# EasyEDA Pro project medulla_2026-05-01.epro

# Schematic Schematic1
Board Name: Board1; Create Date: 2025-12-13; Page Name: P1; Project Name: Kart Medulla (expander for ESP 32); Schematic Name: Schematic1; Update Date: 2026-04-26; Company: EasyEDA.com; Page Size: A4; Version: V1.0
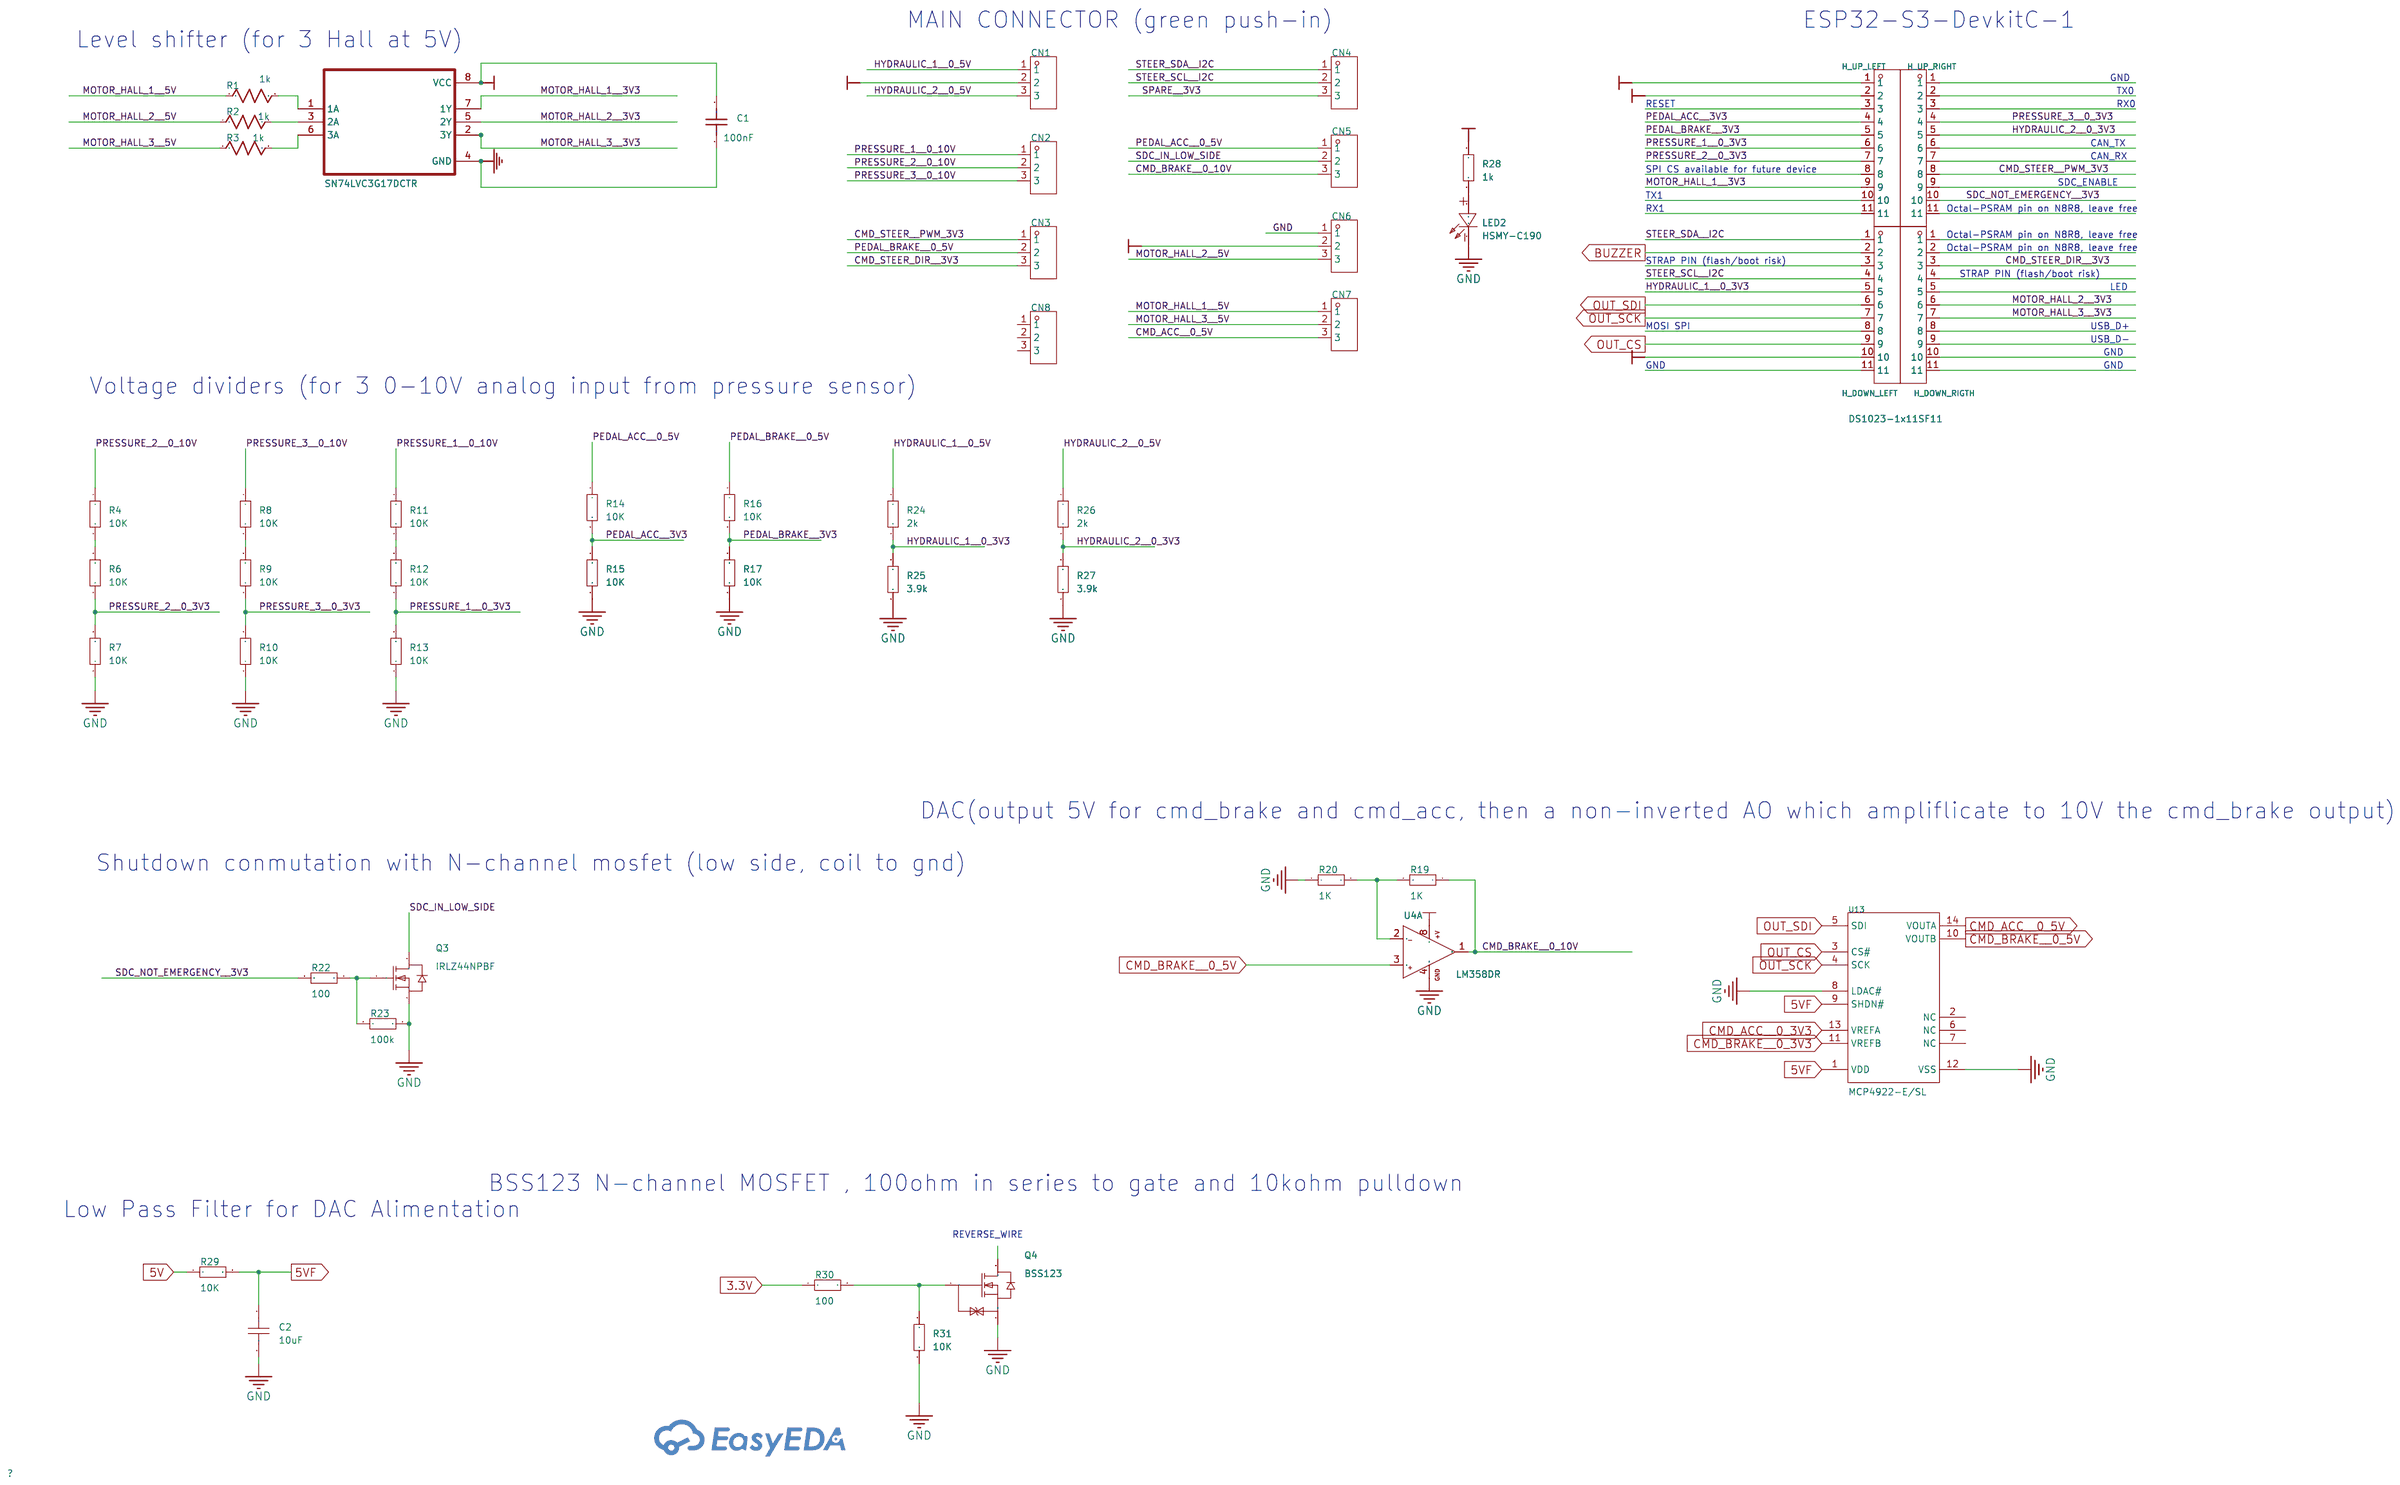
[diagram p0: schematic sheet]

## Parts
C1  100nF  [C0603]
C2  10uF  [C0603]
CN1  1990012  [CONN-TH_3P-P2.50-S5.00_1990012]
CN2  1990012  [CONN-TH_3P-P2.50-S5.00_1990012]
CN3  1990012  [CONN-TH_3P-P2.50-S5.00_1990012]
CN4  1990012  [CONN-TH_3P-P2.50-S5.00_1990012]
CN5  1990012  [CONN-TH_3P-P2.50-S5.00_1990012]
CN6  1990012  [CONN-TH_3P-P2.50-S5.00_1990012]
CN7  1990012  [CONN-TH_3P-P2.50-S5.00_1990012]
CN8  1990012  [CONN-TH_3P-P2.50-S5.00_1990012]
H_DOWN_LEFT  DS1023-1x11SF11  [HDR-TH_11P-P2.54-V-F]
H_DOWN_RIGTH  DS1023-1x11SF11  [HDR-TH_11P-P2.54-V-F]
H_UP_LEFT  DS1023-1x11SF11  [HDR-TH_11P-P2.54-V-F]
H_UP_RIGHT  DS1023-1x11SF11  [HDR-TH_11P-P2.54-V-F]
LED2  HSMY-C190  [LED-SMD_L1.6-W0.8-RD-YELLOW]
Q3  IRLZ44NPBF  [TO-220-3_L10.0-W4.5-P2.54-T]
Q4  BSS123  [SOT-23_L2.9-W1.3-P1.90-LS2.4-BR]
R1  1k  [R0603]
R2  1k  [R0603]
R3  1k  [R0603]
R4  10K  [R0603]
R6  10K  [R0603]
R7  10K  [R0603]
R8  10K  [R0603]
R9  10K  [R0603]
R10  10K  [R0603]
R11  10K  [R0603]
R12  10K  [R0603]
R13  10K  [R0603]
R14  10K  [R0603]
R15  10K  [R0603]
R16  10K  [R0603]
R17  10K  [R0603]
R19  1K  [R0603]
R20  1K  [R0603]
R22  100  [R0603]
R23  100k  [R0603]
R24  2k  [R0603]
R25  3.9k  [R0603]
R26  2k  [R0603]
R27  3.9k  [R0603]
R28  1k  [R0603]
R29  10K  [R0603]
R30  100  [R0603]
R31  10K  [R0603]
U4  LM358DR  [SOIC-8_L5.0-W4.0-P1.27-LS6.0-BL]  (section 1)
U5  SN74LVC3G17DCTR  [SOP65P400X130-8N]
U13  MCP4922-E/SL  [SOIC-14_L8.7-W3.9-P1.27-LS6.0-BL]

## Library data of the parts
C1 = 100nF: nameAlias: Value(F); Contributor: LCEDA_Lib; spicePre: C; spiceSymbolName: C_0603_US
C2 = CAP_0603: Supplier Footprint: 0603
CN1-CN8 = 1990012: Supplier Part: C9900080101; Supplier Footprint: 3P; Supplier: LCSC
H_DOWN_LEFT H_DOWN_RIGTH H_UP_LEFT H_UP_RIGHT = DS1023-1x11SF11: Holes Structure:1x11P Pitch:2.54mm Mounting Type:Through Hole Number of Rows:1 Number of Positions:11P Current Rating:3A Voltage Rating (Max):600V Holes Direction:Top Insulation Height:8.5mm Contact Plating:Gold Operating Temperature:-40℃~+105℃ Operating; LCSC Part Name: 黑色 1x11P 间距:2.54mm 直插; Supplier Part: C7509521; Manufacturer: CONNFLY; Supplier Footprint: 插件,P=2.54mm; JLCPCB Part Class: Extended Part; Datasheet: https://item.szlcsc.com/datasheet/DS1023-1x11SF11/8601957.html; Supplier: LCSC; Holes Structure: 1x11P; Pitch: 2.54mm; Mounting Type: Through Hole; Number of Rows: 1; Number of Positions: 11P; Current Rating: 3A; Voltage Rating (Max): 600V; Holes Direction: Top; Insulation Height: 8.5mm; Contact Plating: Gold; Operating Temperature: -40℃~+105℃
LED2 = HSMY-C190: Illumination Color:Yellow Voltage - Forward(Vf):2.1V Voltage - Forward(Vf):2.1V Power(Watts):52mW Forward Current:20mA Wavelength - Dominant:586nm Wavelength - Dominant:586nm Peak Wavelength:589nm Diode Configuration:- Lens Color:- Color Temperature:- Col; LCSC Part Name: 贴片式芯片LED; Supplier Part: C188736; Manufacturer: Broadcom(博通); Supplier Footprint: 0603; JLCPCB Part Class: Extended Part; Datasheet: https://item.szlcsc.com/datasheet/HSMY-C190/200144.html; Supplier: LCSC; Illumination Color: Yellow; Voltage - Forward(Vf): 2.1V; Power(Watts): 52mW; Forward Current: 20mA; Wavelength - Dominant: 586nm; Peak Wavelength: 589nm; Luminous Intensity: 8mcd; Viewing Angle: 170°; Operating Temperature: -40℃~+85℃
Q3 = IRLZ44NPBF: Type:1 N-Channel Drain Source Voltage (Vdss): Continuous Drain Current (Id): Drain Source On Resistance (RDS(on)@Vgs,Id):0.025Ω@5.0V,25A Power Dissipation (Pd): Gate Threshold Voltage (Vgs(th)@Id):1V@250uA Total Gate Charge (Qg@Vgs):48nC Input Capacitance; LCSC Part Name: 1个N沟道 耐压:55V 电流:47A; Supplier Part: C38774; Manufacturer: Infineon(英飞凌); Supplier Footprint: TO-220AB; JLCPCB Part Class: Extended Part; Datasheet: https://atta.szlcsc.com/upload/public/pdf/source/20141125/1457707250505.pdf; Supplier: LCSC; Type: 1 N-Channel; Drain Source On Resistance (RDS(on)@Vgs,Id): 0.025Ω@5.0V,25A; Gate Threshold Voltage (Vgs(th)@Id): 1V@250uA; Total Gate Charge (Qg@Vgs): 48nC; Input Capacitance (Ciss@Vds): 1.7nF; Reverse Transfer Capacitance (Crss@Vds): 150pF; Operating Temperature: -55℃~+175℃
Q4 = BSS123_C5184436: Number:One N-channel Drain to Source Voltage:100V Current - Continuous Drain(Id):170mA RDS(on):6Ω@10V,0.17A Pd - Power Dissipation:350mW Gate Threshold Voltage (Vgs(th)):2.5V Input Capacitance(Ciss):30pF@50V Reverse Transfer Capacitance (Crss@Vds):7pF@50V; LCSC Part Name: 1个N沟道 耐压:100V 电流:0.17A; Supplier Part: C5184436; Manufacturer: HXY MOSFET(华轩阳电子); Supplier Footprint: SOT-23; JLCPCB Part Class: Extended Part; Datasheet: https://item.szlcsc.com/datasheet/BSS123/5849872.html; Supplier: LCSC; Number: One N-channel; Drain to Source Voltage: 100V; Current - Continuous Drain(Id): 170mA; RDS(on): 6Ω@10V,0.17A; Pd - Power Dissipation: 350mW; Gate Threshold Voltage (Vgs(th)): 2.5V; Input Capacitance(Ciss): 30pF@50V; Reverse Transfer Capacitance (Crss@Vds): 7pF@50V; Operating Temperature: -55℃~+150℃
R1-R3 = 1k: nameAlias: Value(Ω); Contributor: LCEDA_Lib; spicePre: R; spiceSymbolName: R_0603_US
R4 R6-R17 R19 R20 R22-R31 = Res_0603: Supplier Footprint: 0603
U4 = LM358DR: Number of Channels:2 Maximum Power Supply Range (Vdd-Vss):32V Rail to Rail:- Gain Bandwidth Product:700kHz Vos - Input Offset Voltage:3mV Input Offset Voltage Drift(Vos TC):7uV/℃ Slew Rate:300V/ms Ib - Input Bias Current:20nA Input Offset Current(Ios):2nA; LCSC Part Name: 行业标准双路运算放大器; Supplier Part: C5423; Manufacturer: TI(德州仪器); Supplier Footprint: SOIC-8; JLCPCB Part Class: Extended Part; Datasheet: https://www.ti.com/cn/lit/gpn/lm358; Supplier: LCSC; Number of Channels: 2; Maximum Power Supply Range (Vdd-Vss): 32V; Gain Bandwidth Product: 700kHz; Vos - Input Offset Voltage: 3mV; Input Offset Voltage Drift(Vos TC): 7uV/℃; Slew Rate: 300V/ms; Ib - Input Bias Current: 20nA; Input Offset Current(Ios): 2nA; Noise density(eN): 40nV/√Hz@1kHz; Common Mode Rejection Ratio(CMRR): 99dB; Input offset current drift(Ios TC): 10pA/℃; Quiescent Current: 700uA; Output Current: 20mA; Operating Temperature: 0℃~+70℃; Single supply: 3V~32V; Dual Supply: -16V~16V
U5 = SN74LVC3G17DCTR
U13 = MCP4922-E/SL: Resolution(Bits):12 Number of Channels:2 Interface:SPI Voltage - Supply:2.7V~5.5V Voltage - Supply:2.7V~5.5V Settling Time:4.5us Output Type:Voltage Buffer Integral non - linearity:0.2LSB Integral non - linearity:0.2LSB Operating Temperature:-40℃~+125℃ Op; LCSC Part Name: 8/10/12位双电压输出数模转换器，带SPI接口; Supplier Part: C39851; Manufacturer: MICROCHIP(美国微芯); Supplier Footprint: SOIC-14; JLCPCB Part Class: Extended Part; Datasheet: https://item.szlcsc.com/datasheet/MCP4922-E%252FSL/40833.html; Supplier: LCSC; Resolution(Bits): 12; Number of Channels: 2; Interface: SPI; Voltage - Supply: 2.7V~5.5V; Settling Time: 4.5us; Output Type: Voltage Buffer; Integral non - linearity: 0.2LSB; Operating Temperature: -40℃~+125℃; Power-On Reset: Built-in; Voltage Reference: External; Quiescent Current (Iq): 350uA

## Nets
3.3V: R30.1
3V3: C1.2 CN1.2 H_UP_LEFT.1 H_UP_LEFT.2 R28.1 U5.8(VCC)
5V: H_DOWN_LEFT.10 R29.1
5VF: C2.1 R29.2 U13.1(VDD) U13.9(SHDN#)
12V: CN6.2 U4.8(+V)
GND: C1.1 C2.2 CN6.1 LED2.1(A) Q3.3(S) Q4.2(S) R7.1 R10.1 R13.1 R15.1 R17.1 R20.1 R23.1 R25.1 R27.1 R31.1 U4.4(GND) U5.4(GND) U13.8(LDAC#) U13.12(VSS)
BUZZER: H_DOWN_LEFT.2
CMD_ACC__0_3V3: U13.13(VREFA)
CMD_ACC__0_5V: CN7.3 U13.14(VOUTA)
CMD_BRAKE__0_3V3: U13.11(VREFB)
CMD_BRAKE__0_5V: U4.3(+IN1) U13.10(VOUTB)
CMD_BRAKE__0_10V: CN5.3 R19.1 U4.1(OUT1)
CMD_STEER__PWM_3V3: CN3.1 H_UP_RIGHT.8
CMD_STEER_DIR__3V3: CN3.3 H_DOWN_RIGTH.3
HYDRAULIC_1__0_3V3: H_DOWN_LEFT.5 R24.2 R25.2
HYDRAULIC_1__0_5V: CN1.1 R24.1
HYDRAULIC_2__0_3V3: H_UP_RIGHT.5 R26.2 R27.2
HYDRAULIC_2__0_5V: CN1.3 R26.1
MOTOR_HALL_1__3V3: H_UP_LEFT.9 U5.7(1Y)
MOTOR_HALL_1__5V: CN7.1 R1.1
MOTOR_HALL_2__3V3: H_DOWN_RIGTH.6 U5.5(2Y)
MOTOR_HALL_2__5V: CN6.3 R2.1
MOTOR_HALL_3__3V3: H_DOWN_RIGTH.7 U5.2(3Y)
MOTOR_HALL_3__5V: CN7.2 R3.1
OUT_CS: H_DOWN_LEFT.9 U13.3(CS#)
OUT_SCK: H_DOWN_LEFT.7 U13.4(SCK)
OUT_SDI: H_DOWN_LEFT.6 U13.5(SDI)
PEDAL_ACC__0_5V: CN5.1 R14.1
PEDAL_ACC__3V3: H_UP_LEFT.4 R14.2 R15.2
PEDAL_BRAKE__0_5V: CN3.2 R16.1
PEDAL_BRAKE__3V3: H_UP_LEFT.5 R16.2 R17.2
PRESSURE_1__0_3V3: H_UP_LEFT.6 R12.1 R13.2
PRESSURE_1__0_10V: CN2.1 R11.1
PRESSURE_2__0_3V3: H_UP_LEFT.7 R6.1 R7.2
PRESSURE_2__0_10V: CN2.2 R4.1
PRESSURE_3__0_3V3: H_UP_RIGHT.4 R9.1 R10.2
PRESSURE_3__0_10V: CN2.3 R8.1
SDC_IN_LOW_SIDE: CN5.2 Q3.2(D)
SDC_NOT_EMERGENCY__3V3: H_UP_RIGHT.10 R22.2
SPARE__3V3: CN4.3
STEER_SCL__I2C: CN4.2 H_DOWN_LEFT.4
STEER_SDA__I2C: CN4.1 H_DOWN_LEFT.1
$1N247: R1.2 U5.1(1A)
$1N249: R2.2 U5.3(2A)
$1N250: R3.2 U5.6(3A)
$1N1811: R4.2 R6.2
$1N18631: R8.2 R9.2
$1N18724: R11.2 R12.2
$1N21883: R19.2 R20.2 U4.2(-IN1)
$1N22832: Q3.1(G) R22.1 R23.2
$1N32768: LED2.2(C) R28.2
$1N45076: Q4.1(G) R30.2 R31.2

Not connected (* = marked no-connect by the designer): CN8 1 2 3; H_DOWN_LEFT 3 8 11; H_DOWN_RIGTH 1 2 4 5 8 9 10 11; H_UP_LEFT 3 8 10 11; H_UP_RIGHT 1 2 3 6 7 9 11; Q4 3(D); U13 2(NC) 6(NC) 7(NC)

## Notes on the sheet
- MAIN CONNECTOR (green push-in)
- ESP32-S3-DevkitC-1
- Level shifter (for 3 Hall at 5V)
- GND
- RESET
- RX0
- TX0
- CAN_TX
- CAN_RX
- SPI CS available for future device
- SDC_ENABLE
- TX1
- RX1
- Octal-PSRAM pin on N8R8, leave free
- Octal-PSRAM pin on N8R8, leave free
- Octal-PSRAM pin on N8R8, leave free
- STRAP PIN (flash/boot risk)
- STRAP PIN (flash/boot risk)
- LED
- MOSI SPI
- USB_D+
- USB_D-
- GND
- GND
- GND
- Voltage dividers (for 3 0-10V analog input from pressure sensor)
- DAC(output 5V for cmd_brake and cmd_acc, then a non-inverted AO which ampliflicate to 10V the cmd_brake output)
- Shutdown conmutation with N-channel mosfet (low side, coil to gnd)
- BSS123 N-channel MOSFET , 100ohm in series to gate and 10kohm pulldown
- Low Pass Filter for DAC Alimentation
- REVERSE_WIRE

# Board PCB1
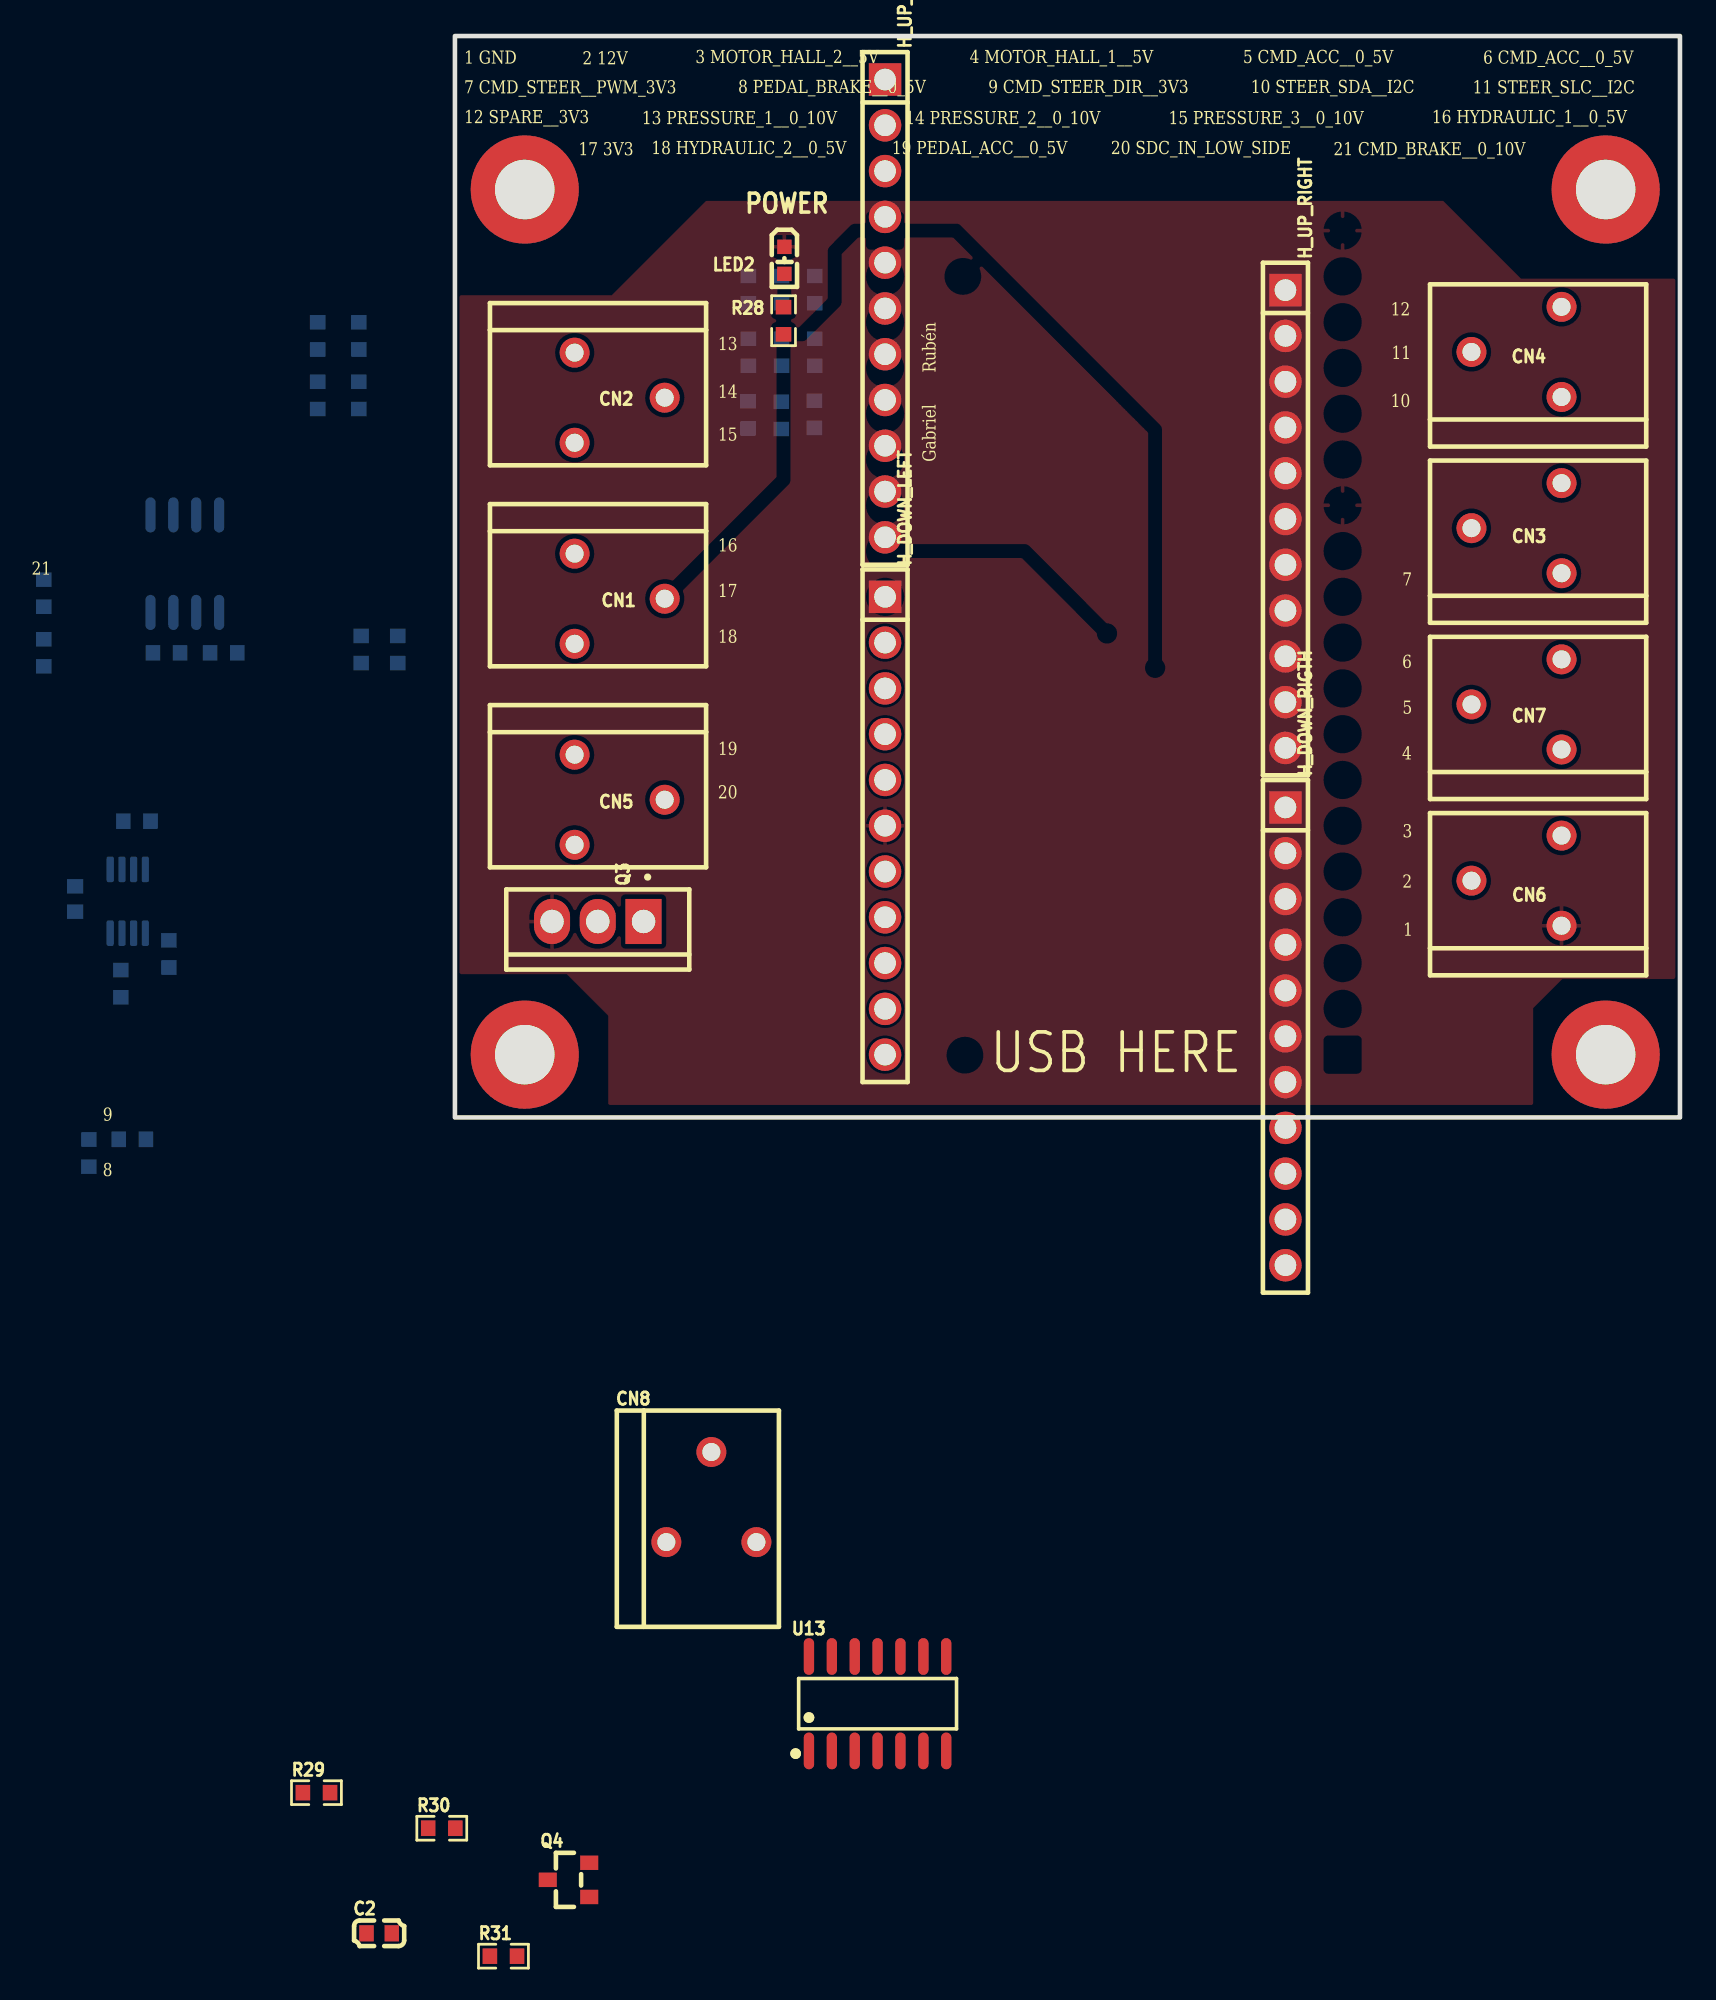
[diagram p1: board, top side]
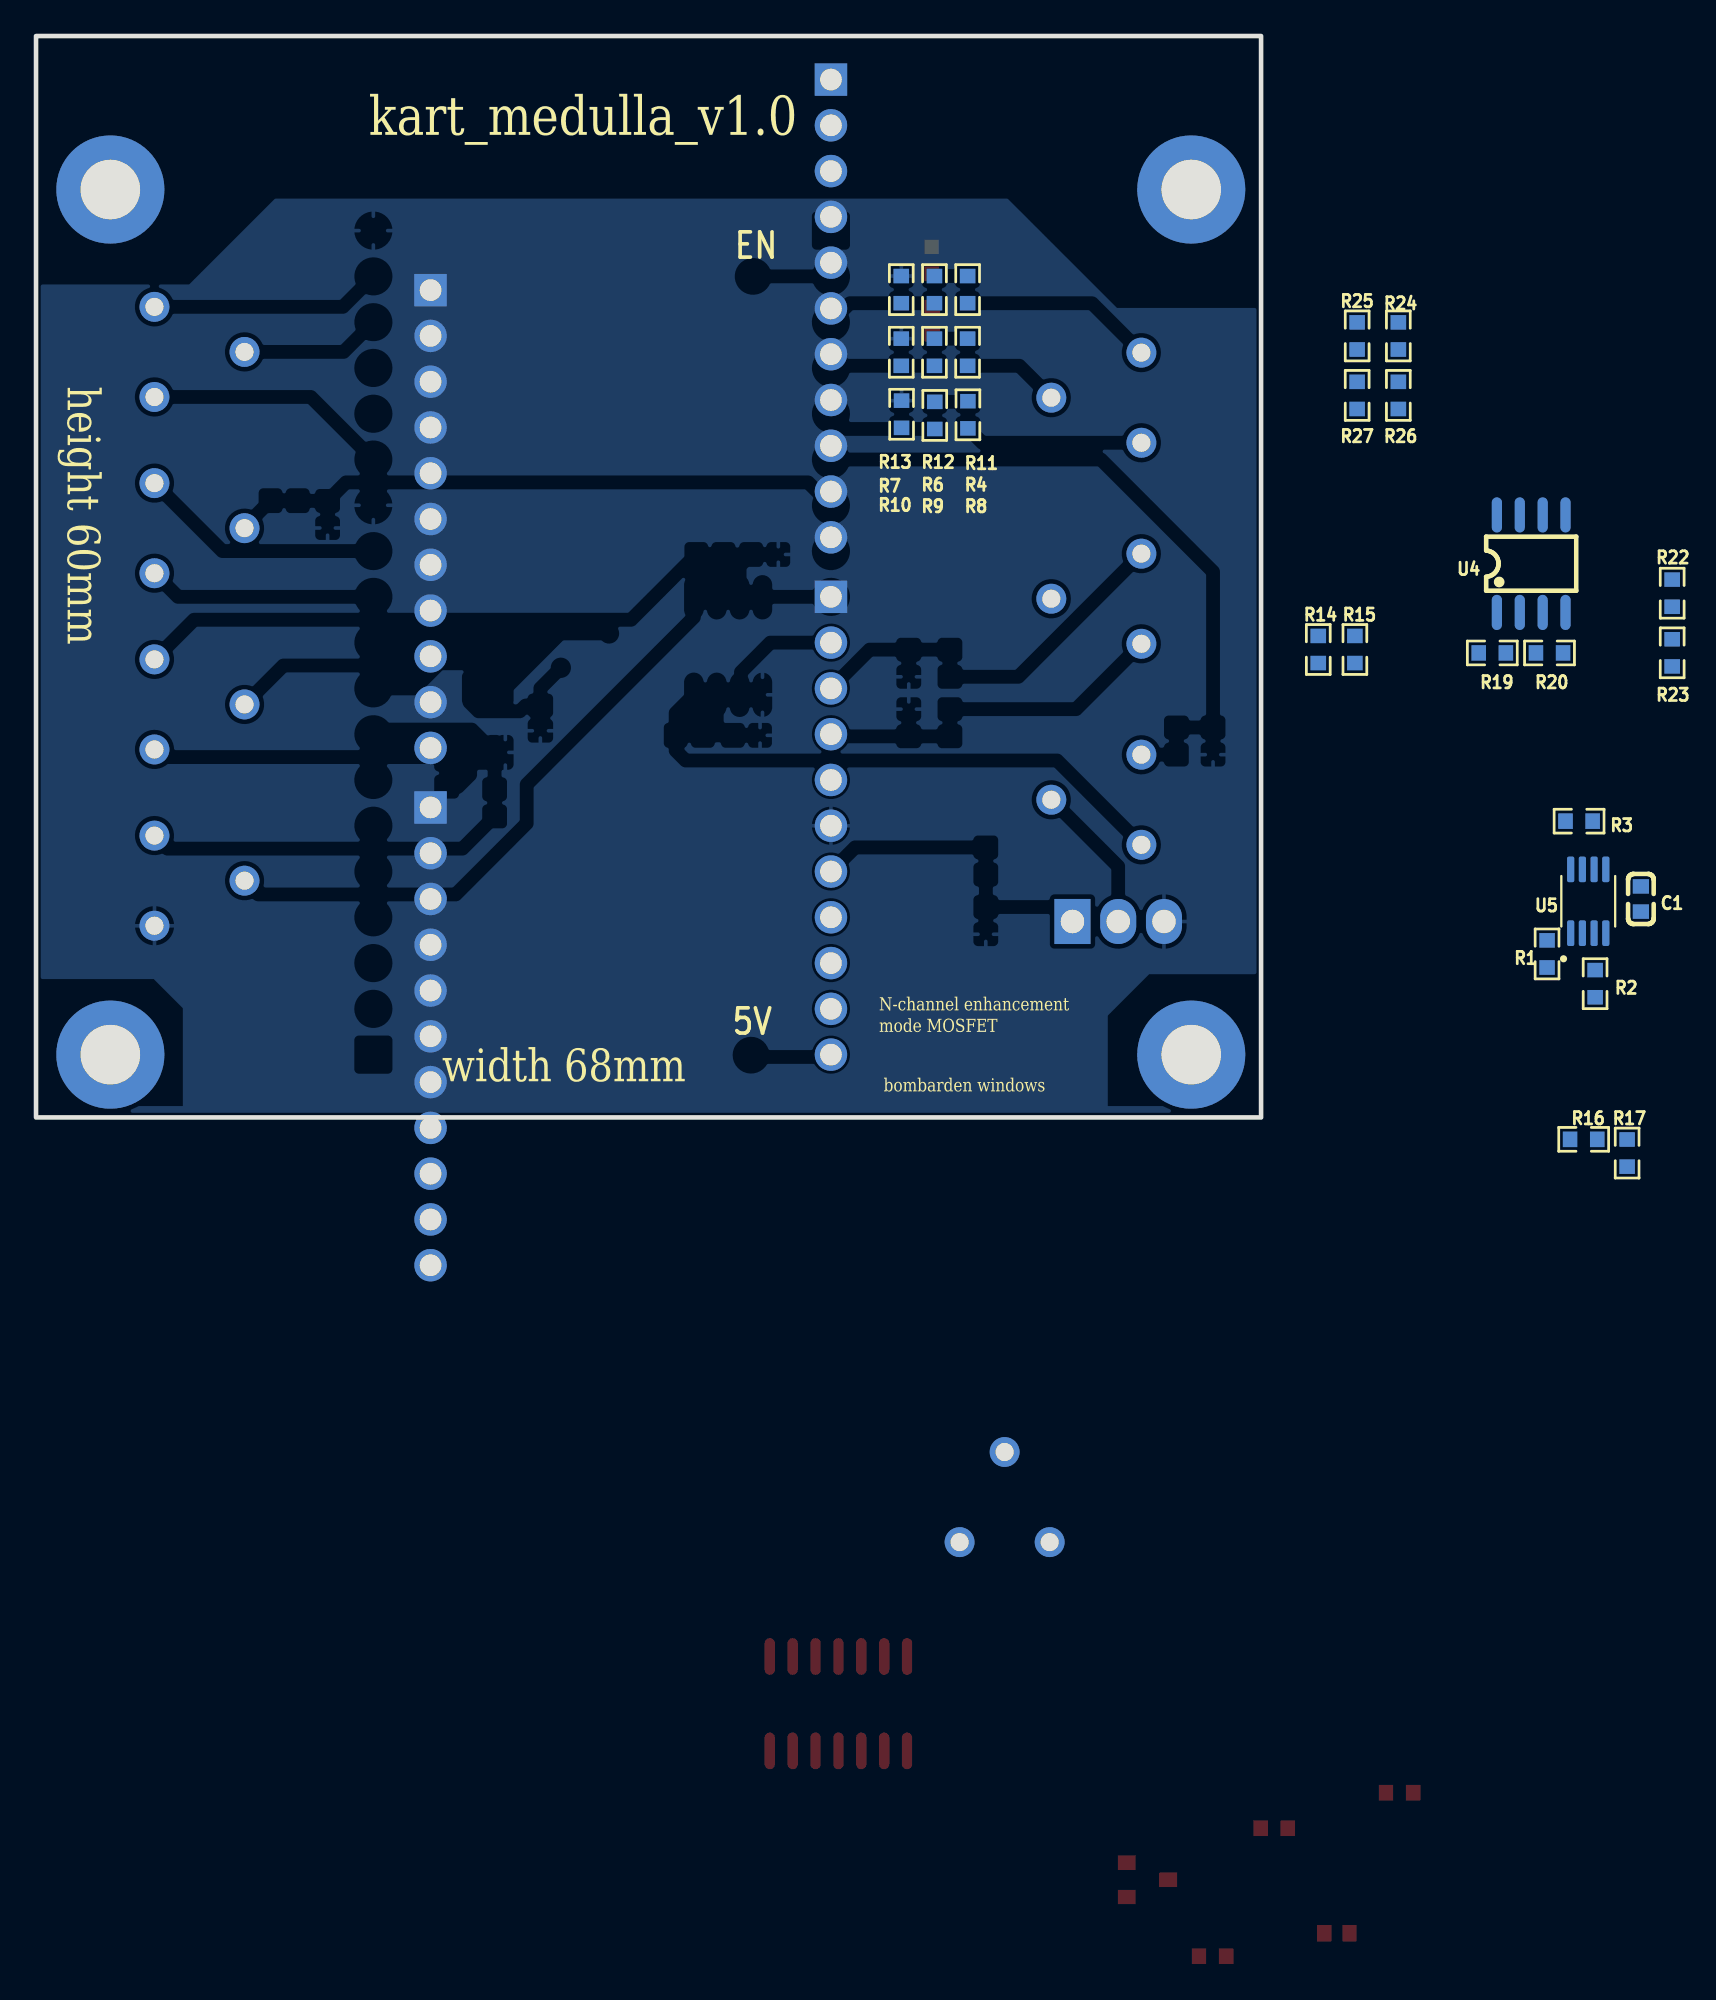
[diagram p2: board, bottom side, seen from below]

Outline 68 x 60 mm; copper layers: Top Layer, Bottom Layer. Coordinates in mm from the lower left corner of the outline.
Outline path: rectangle 0,60 68,0
Stack: Top Layer 0.035mm / Dielectric1 1.51mm FR4 er 4.5 / Bottom Layer 0.035mm

## Design rules (mm)
template: JLCPCB Capability(Two Layers Board)
spacing copperThickness1oz (default): track to track 0.102, other pairs 0.152 to 0.3
spacing copperThickness2oz: track to track 0.203, other pairs 0.152 to 0.3
track width copperThickness1oz (default): min 0.127, default 0.254, max 2.54
track width copperThickness2oz: min 0.203, default 0.254, max 2.54
differential pair differentialPair (default): width min 0.127, default 0.254, max 2.54; gap min 0.152, default 0.152
via viaSize (default): diameter min 0.5, default 0.61, max 10; hole min 0.3, default 0.305, max 6.3

## Placement (name value [footprint] x y rotation side)
C1  100nF  [C0603]  -21.08 12.12 90 bottom
C2  10uF  [C0603]  -4.21 -45.27 0 top
CN1  1990012  [CONN-TH_3P-P2.50-S5.00_1990012]  9.14 28.78 270 top
CN2  1990012  [CONN-TH_3P-P2.50-S5.00_1990012]  9.14 39.93 270 top
CN3  1990012  [CONN-TH_3P-P2.50-S5.00_1990012]  58.93 32.7 90 top
CN4  1990012  [CONN-TH_3P-P2.50-S5.00_1990012]  58.93 42.47 90 top
CN5  1990012  [CONN-TH_3P-P2.50-S5.00_1990012]  9.14 17.63 270 top
CN6  1990012  [CONN-TH_3P-P2.50-S5.00_1990012]  58.93 13.14 90 top
CN7  1990012  [CONN-TH_3P-P2.50-S5.00_1990012]  58.93 22.92 90 top
CN8  1990012  [CONN-TH_3P-P2.50-S5.00_1990012]  14.24 -21.06 0 top
H_DOWN_LEFT  DS1023-1x11SF11  [HDR-TH_11P-P2.54-V-F]  23.88 16.19 270 top
H_DOWN_RIGTH  DS1023-1x11SF11  [HDR-TH_11P-P2.54-V-F]  46.1 4.5 270 top
H_UP_LEFT  DS1023-1x11SF11  [HDR-TH_11P-P2.54-V-F]  23.88 44.89 270 top
H_UP_RIGHT  DS1023-1x11SF11  [HDR-TH_11P-P2.54-V-F]  46.1 33.2 270 top
LED2  HSMY-C190  [LED-SMD_L1.6-W0.8-RD-YELLOW]  18.29 47.55 270 top
NOREF  -  [Pad_e1420]  63.88 3.49 0 top
NOREF#2  -  [Pad_e1413]  3.88 3.49 0 top
NOREF#3  -  [Pad_e1421]  3.88 51.49 0 top
NOREF#4  -  [Pad_e1422]  63.88 51.49 0 top
Q3  IRLZ44NPBF  [TO-220-3_L10.0-W4.5-P2.54-T]  7.93 10.87 270 top
Q4  BSS123  [SOT-23_L2.9-W1.3-P1.90-LS2.4-BR]  6.31 -42.3 0 top
R1  1k  [R0603]  -15.88 9.07 270 bottom
R2  1k  [R0603]  -18.54 7.42 90 bottom
R3  1k  [R0603]  -17.65 16.44 180 bottom
R4  10K  [R0603]  16.29 42.46 90 bottom
R6  10K  [R0603]  18.13 42.46 90 bottom
R7  10K  [R0603]  19.97 42.46 270 bottom
R8  10K  [R0603]  16.27 38.99 90 bottom
R9  10K  [R0603]  18.11 38.95 90 bottom
R10  10K  [R0603]  19.96 39.02 270 bottom
R11  10K  [R0603]  16.29 45.93 90 bottom
R12  10K  [R0603]  18.13 45.93 90 bottom
R13  10K  [R0603]  19.97 45.93 270 bottom
R14  10K  [R0603]  -3.17 25.96 90 bottom
R15  10K  [R0603]  -5.21 25.96 90 bottom
R16  10K  [R0603]  -17.91 -1.21 180 bottom
R17  10K  [R0603]  -20.32 -1.98 90 bottom
R19  1K  [R0603]  -12.84 25.77 180 bottom
R20  1K  [R0603]  -16.01 25.77 0 bottom
R22  100  [R0603]  -22.82 29.09 90 bottom
R23  100k  [R0603]  -22.82 25.78 90 bottom
R24  2k  [R0603]  -7.62 43.36 90 bottom
R25  3.9k  [R0603]  -5.33 43.36 90 bottom
R26  2k  [R0603]  -7.62 40.06 270 bottom
R27  3.9k  [R0603]  -5.33 40.06 270 bottom
R28  1k  [R0603]  18.24 44.21 90 top
R29  10K  [R0603]  -7.69 -37.46 0 top
R30  100  [R0603]  -0.73 -39.44 0 top
R31  10K  [R0603]  2.69 -46.54 0 top
U4  LM358DR  [SOIC-8_L5.0-W4.0-P1.27-LS6.0-BL]  -14.99 30.73 180 bottom
U5  SN74LVC3G17DCTR  [SOP65P400X130-8N]  -18.16 11.99 90 bottom
U13  MCP4922-E/SL  [SOIC-14_L8.7-W3.9-P1.27-LS6.0-BL]  23.46 -32.53 0 top

## Footprints (pads in the part's own frame, mm; a bottom-side part is the same pattern mirrored in y, then rotated)
C0603
  rect 0.8x0.9 smd: 1(-0.7,0) 2(0.7,0)
CONN-TH_3P-P2.50-S5.00_1990012
  round 1.66 hole 1: 1(-2.5,-2.5) 2(0,2.5) 3(2.5,-2.5)
HDR-TH_11P-P2.54-V-F
  rect 1.8x1.8 hole 1.2: 1(-12.7,0)
  round 1.8 hole 1.2: 2(-10.16,0) 3(-7.62,0) 4(-5.08,0) 5(-2.54,0) 6(0,0) 7(2.54,0) 8(5.08,0) 9(7.62,0) 10(10.16,0) 11(12.7,0)
LED-SMD_L1.6-W0.8-RD-YELLOW
  rect 0.8x0.8 smd: 1(-0.75,0) 2(0.75,0)
Pad_e1413
  round 6 hole 3.3: 1(0,0)
Pad_e1420
  round 6 hole 3.3: 1(0,0)
Pad_e1421
  round 6 hole 3.3: 1(0,0)
Pad_e1422
  round 6 hole 3.3: 1(0,0)
R0603
  rect 0.806x0.864 smd: 1(-0.753,0) 2(0.753,0)
SOIC-8_L5.0-W4.0-P1.27-LS6.0-BL
  oval 0.569x1.95 smd: 1(-1.905,-2.705) 2(-0.635,-2.705) 3(0.635,-2.705) 4(1.905,-2.705) 5(1.905,2.705) 6(0.635,2.705) 7(-0.635,2.705) 8(-1.905,2.705)
SOIC-14_L8.7-W3.9-P1.27-LS6.0-BL
  oval 0.574x2.038 smd: 1(-3.81,-2.619) 2(-2.54,-2.619) 3(-1.27,-2.619) 4(0,-2.619) 5(1.27,-2.619) 6(2.54,-2.619) 7(3.81,-2.619) 8(3.81,2.619) 9(2.54,2.619) 10(1.27,2.619) 11(0,2.619) 12(-1.27,2.619) 13(-2.54,2.619) 14(-3.81,2.619)
SOP65P400X130-8N
  rrect 1.42x0.4 smd: 1(-1.77,0.975) 2(-1.77,0.325) 3(-1.77,-0.325) 4(-1.77,-0.975) 5(1.77,-0.975) 6(1.77,-0.325) 7(1.77,0.325) 8(1.77,0.975)
SOT-23_L2.9-W1.3-P1.90-LS2.4-BR
  rect 1x0.8 smd: 1(1.15,-0.95) 2(1.15,0.95) 3(-1.15,0)
TO-220-3_L10.0-W4.5-P2.54-T
  rect 2.5x2 hole 1.3: 1(0,2.54)
  oval 2.5x2 hole 1.3: 2(0,0) 3(0,-2.54)

## Nets
As in the schematic, except:
5V: R29.1
CMD_STEER_DIR__3V3: CN3.3
HYDRAULIC_1__0_3V3: R24.2 R25.2
MOTOR_HALL_2__3V3: U5.5
MOTOR_HALL_3__3V3: U5.2
OUT_CS: U13.3
OUT_SCK: U13.4
OUT_SDI: U13.5
STEER_SCL__I2C: CN4.2
STEER_SDA__I2C: CN4.1

Pads without a net: CN8 1 2 3; H_DOWN_LEFT 1 2 3 4 5 6 7 8 9 10 11; H_DOWN_RIGTH 1 2 3 4 5 6 7 8 9 10 11; NOREF 1; NOREF#2 1; NOREF#3 1; NOREF#4 1; U4 5 6 7; U13 2 6 7

## Copper pours and planes (outline as drawn; the poured copper is in the pictures)
GND on Top Layer: -9.14,50.86 68.96,50.86 68.96,0.69 -9.14,0.69
GND on Bottom Layer: -2.92,50.98 80.65,50.98 80.65,0.06 -2.92,0.06

## Text on the board
Bottom Silkscreen Layer: EN | 5V | bombarden windows | N-channel enhancement / mode MOSFET | width 68mm | height 60mm | kart_medulla_v1.0
Top Silkscreen Layer: POWER | USB HERE | 21 | 8 | 9 | 1 GND | 7 CMD_STEER__PWM_3V3 | 12 SPARE__3V3 | 17 3V3 | 2 12V | 13 PRESSURE_1__0_10V | 18 HYDRAULIC_2__0_5V | 3 MOTOR_HALL_2__5V | 13 | 14 | 15 | 16 | 17 | 18 | 19 | 20 | 8 PEDAL_BRAKE__0_5V | 19 PEDAL_ACC__0_5V | 14 PRESSURE_2__0_10V | 4 MOTOR_HALL_1__5V | 9 CMD_STEER_DIR__3V3 | 20 SDC_IN_LOW_SIDE | 15 PRESSURE_3__0_10V | 5 CMD_ACC__0_5V | 10 STEER_SDA__I2C | 21 CMD_BRAKE__0_10V | 12 | 10 | 11 | 4 | 6 | 7 | 2 | 5 | 3 | 1 | 16 HYDRAULIC_1__0_5V | 11 STEER_SLC__I2C | 6 CMD_ACC__0_5V | Gabriel | Rubén
